# EAGLE design 5V_XL4016_Buck_Converter_2023_05_04_A (EAGLE 9.6.1)
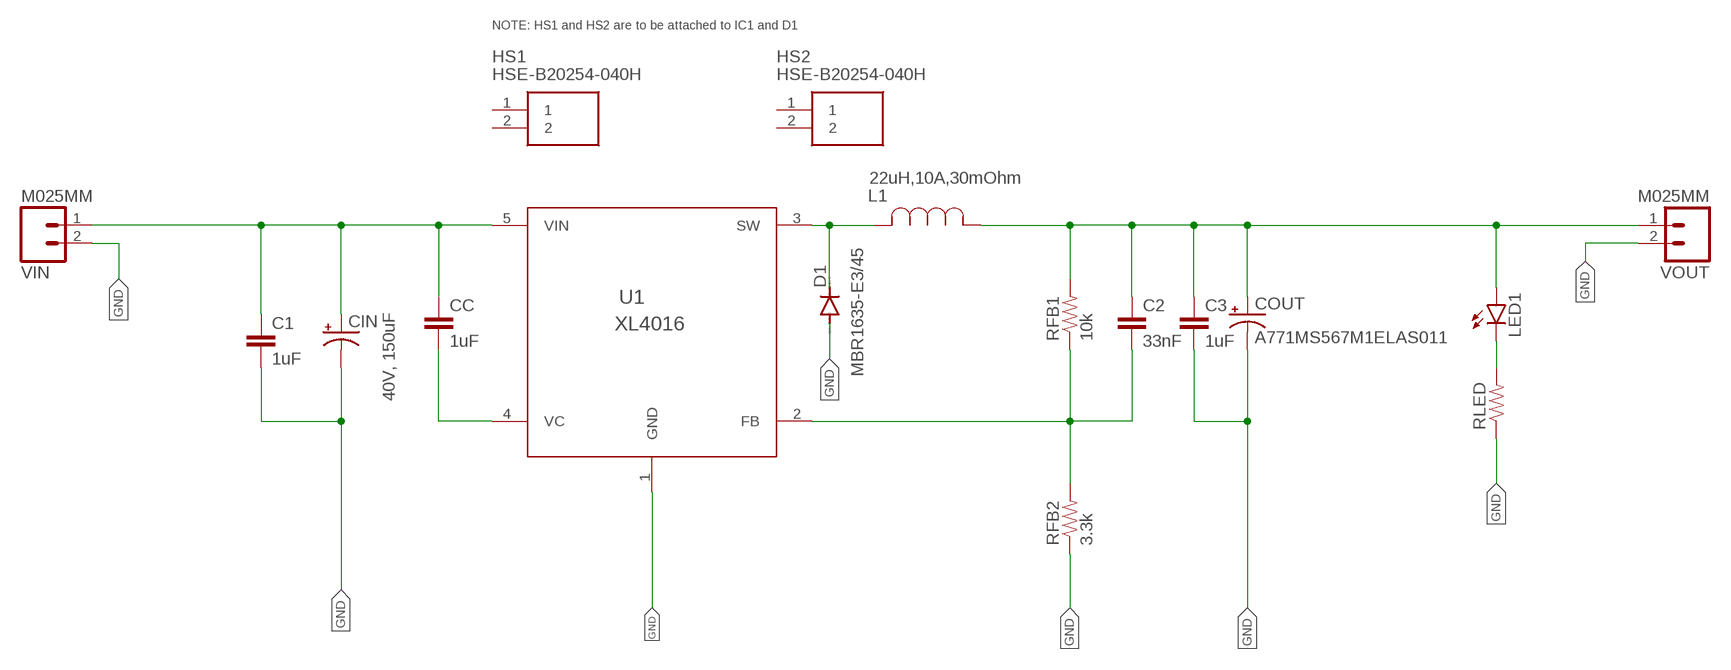
[diagram p0: schematic, sheet 1]

## Parts
C1  1uF  CAP0805  [0805]
C2  33nF  CAP0805  [0805]
C3  1uF  CAP0805  [0805]
CC  1uF  CAP0805  [0805]
CIN  40V, 150uF  A768KS157M1GLAS025CAP_A768_KEM-M  [CAP_A768_KEM-M]
COUT  A771MS567M1ELAS011  CPOL-US153CLV-1012  [153CLV-1012]
D1  MBR1635-E3/45  FES08AT  [DO220S]
HS1  HSE-B20254-040H  [HSEB20254040H]
HS2  HSE-B20254-040H  [HSEB20254040H]
L1  22uH,10A,30mOhm  SRP1265C-4R7MIND_SRP1265C-LEADFRAME_BRN-M  [IND_SRP1265C-LEADFRAME_BRN-M]
LED1  LED1206  [LED-1206]
RFB1  10k  RESISTOR0805-RES  [0805]
RFB2  3.3k  RESISTOR0805-RES  [0805]
RLED  RESISTOR0805-RES  [0805]
U1  XL4016  [TO220-5L]
VIN  M025MM  [SCREWTERMINAL-5MM-2]
VOUT  M025MM  [SCREWTERMINAL-5MM-2]

## Nets
FB: C2.2 RFB1.1 RFB2.2 U1.2(FB)
GND: C1.2 C3.2 CIN.2(-) COUT.- D1.A RFB2.1 RLED.1 U1.1(GND) VIN.2 VOUT.2
N$1: LED1.C RLED.2
SW: D1.C L1.2 U1.3(SW)
VC: CC.2 U1.4(VC)
VIN: C1.1 CC.1 CIN.1(+) U1.5(VIN) VIN.1
VOUT: C2.1 C3.1 COUT.+ L1.1 LED1.A RFB1.2 VOUT.1
Unconnected: HS1.1 HS1.2 HS2.1 HS2.2

## Notes on the sheet
- NOTE: HS1 and HS2 are to be attached to IC1 and D1

## Library data of the parts
C1-C3 CC = SparkFun-Capacitors:CAP: Capacitor Standard 0603 ceramic capacitor, and 0.1" leaded capacitor.
CIN = KMET_A768_12mm:A768KS157M1GLAS025; COPYRIGHT: Copyright (C) 2023 Ultra Librarian. All rights reserved.; MANUFACTURER_PART_NUMBER: A768KS157M1GLAS025; MFR_NAME: Kemet
COUT = rcl:CPOL-US: POLARIZED CAPACITOR, American symbol; SPICEPREFIX: C
D1 = diode:FES08AT: DIODE ultra-fast recovery rectifier
HS1 HS2 = HSE-B20254-040H:HSE-B20254-040H: Heat Sinks 25.4x32x20mm w/pin extrusion TO-220 Source: Datasheet <https://datasheet.datasheetarchive.com/originals/distributors/DKDS-12/236902.pdf>; DESCRIPTION: Heat Sinks 25.4x32x20mm w/pin extrusion TO-220; HEIGHT: 25.9mm; MANUFACTURER_NAME: CUI Devices; MANUFACTURER_PART_NUMBER: HSE-B20254-040H; MOUSER_PART_NUMBER: 490-HSE-B20254-040H; MOUSER_PRICE-STOCK: https://www.mouser.co.uk/ProductDetail/CUI-Devices/HSE-B20254-040H?qs=5aG0NVq1C4wagxcVQ2hrmA%3D%3D
L1 = SRP1265C-220M:SRP1265C-4R7M; COPYRIGHT: Copyright (C) 2023 Ultra Librarian. All rights reserved.; MANUFACTURER_PART_NUMBER: SRP1265C-4R7M; MFR_NAME: Bourns Electronics; TYPE: Fixed Inductors
LED1 = SparkFun-LED:LED: LEDs Standard schematic elements and footprints for 5mm, 3mm, 1206, and 0603 sized LEDs. 5mm - Spark Fun Electronics SKU : COM-00529 (and others)
RFB1 RFB2 RLED = SparkFun-Resistors:RESISTOR: Resistor Basic schematic elements and footprints for 0603, 1206, and PTH resistors.
U1 = XL4016:XL4016; COPYRIGHT: Copyright (C) 2023 Ultra Librarian. All rights reserved.; MANUFACTURER_PART_NUMBER: LM2575T-12/NOPB; MFR_NAME: Texas Instruments; REFDES: RefDes; TYPE: TYPE
VIN VOUT = SparkFun-Connectors:M02: Standard 2-pin 0.1" header. Use with - straight break away headers ( PRT-00116) - right angle break away headers (PRT-00553) - swiss pins (PRT-00743) - machine pins (PRT-00117) - female headers (PRT-00115) Molex polarized connector foot print use with: PRT-08233 with associated crimp pins and housings. 2.54_SCREWTERM for use with PRT-10571. 3.5mm Screw Terminal footprints for PRT-08084 5mm Screw Terminal footprints for use with PRT-08432; STOREFRONT_ID: PRT-08432

## Board
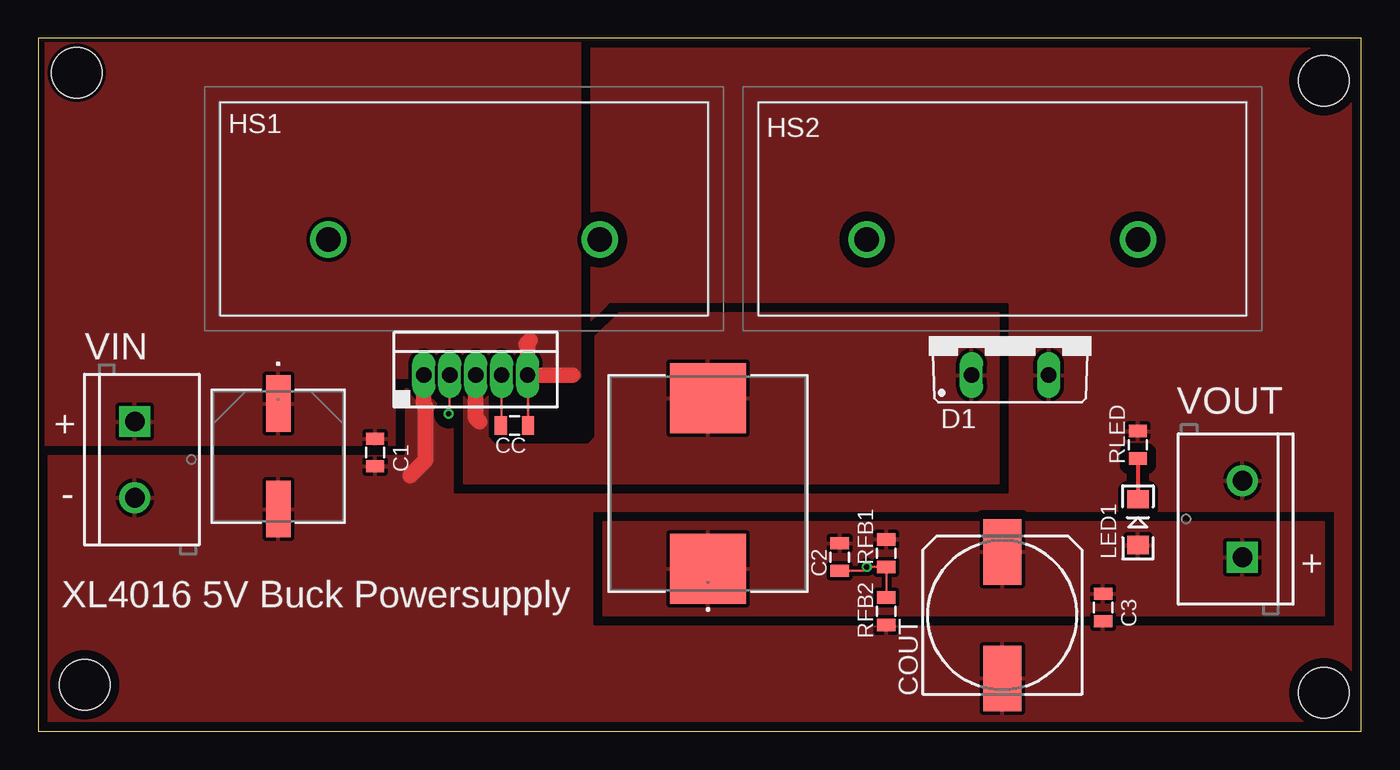
[diagram p1: board, top side]
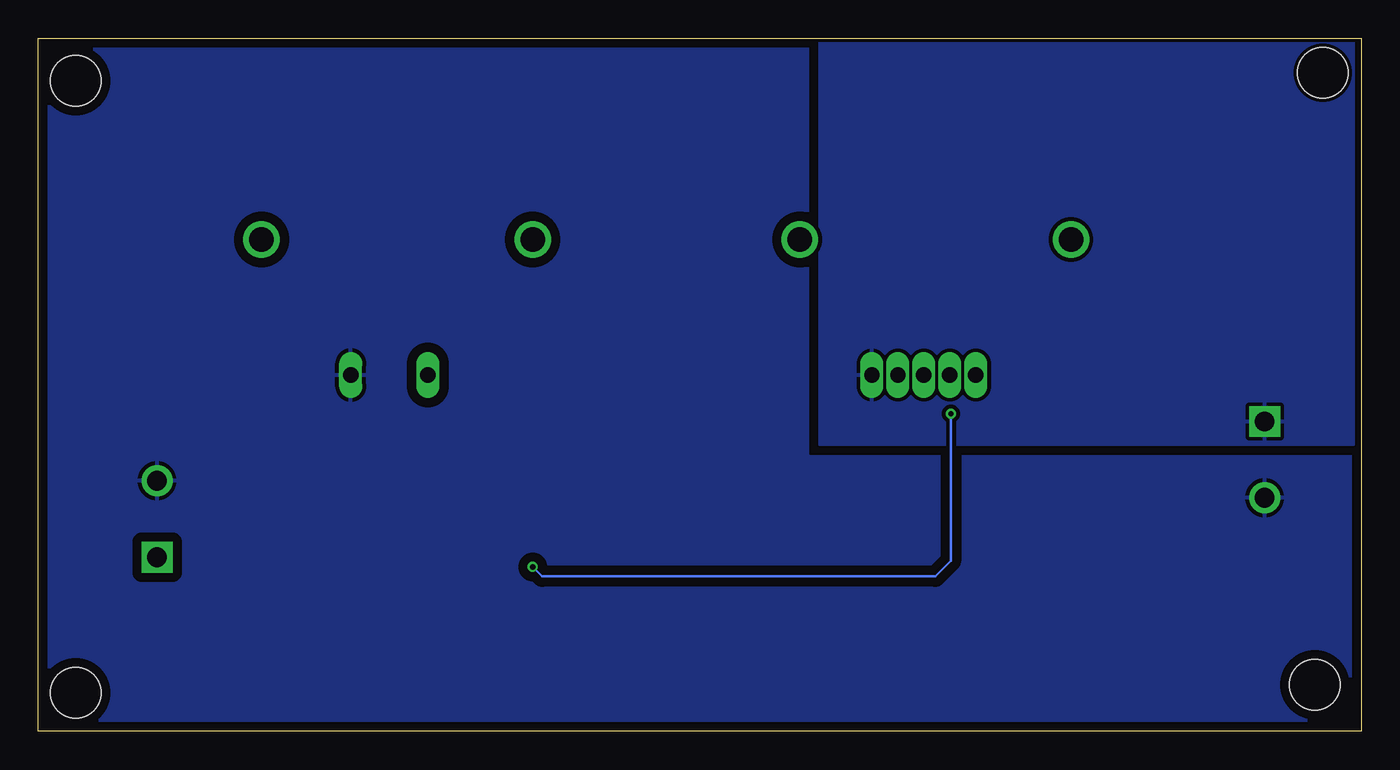
[diagram p2: board, bottom side, seen from below]

Size 86.79 x 45.46 mm. Coordinates in mm from the lower left corner, seen from the top.
Outline: 0,0 86.79,0 86.79,45.46 0,45.46 0,0
Copper layers (1*16): Top 0.035mm / dielectric 1.5mm / Bottom 0.035mm
Design rules "default": minimum track width 5mil, minimum drill 5mil, track to track 10mil, track to pad 10mil, pad to pad 10mil, via to via 10mil, smd to smd 6mil, copper to edge 10mil, drill to drill 6mil, minimum pad ring 6mil, minimum via ring 6mil, stop-mask expansion 4mil, vias tented up to drill 0mil, thermal gap 10mil
Holes 3.3 mm at 2.54,43.18 84.33,42.67 3.05,3.05 84.33,2.54

### Footprints (pad centres in the part's own frame; a part is rotated, then mirrored left to right if it is on the bottom)
0805 = smd 0.8 x 1.2: 1 -0.9,0; 2 0.9,0
CAP_A768_KEM-M = smd 3.708 x 1.6: 1 -3.454,0; 2 3.454,0
153CLV-1012 = smd 4.3 x 2.5: + 4.15,0; - -4.15,0
DO220S = drill 1.016 long: A 2.54,-2.54; C -2.54,-2.54
HSEB20254040H = drill 1.6 pad 2.4: 1 0,0; 2 17.78,0
IND_SRP1265C-LEADFRAME_BRN-M = smd 4.572 x 5.004: 1 -5.588,0; 2 5.588,0
LED-1206 = smd 1.2 x 1.4: A -1.5,0; C 1.5,0
TO220-5L = drill 1 pad 1.27 long: 1 0,3.404; 2 0,1.702; 3 0,0; 4 0,-1.702; 5 0,-3.404
SCREWTERMINAL-5MM-2 = drill 1.3 pad 2.032 square: 1 0,0 | drill 1.3 pad 2.032: 2 5,0

### Placement (x,y rotation side)
C1  22.1,18.29 270 top
C2  52.58,11.43 270 top
C3  69.85,8.13 270 top
CC  31.24,20.07 180 top
CIN  15.75,18.03 270 top
COUT  63.25,7.62 90 top
D1  63.75,25.91 0 top
HS1  19.05,32.26 0 top
HS2  54.36,32.26 0 top
L1  43.94,16.26 90 top
LED1  72.14,13.72 90 top
RFB1  55.63,11.68 90 top
RFB2  55.63,7.87 90 top
RLED  72.14,18.8 270 top
U1  28.7,23.37 90 top
VIN  6.35,20.32 270 top
VOUT  78.99,11.43 90 top

### Tracks (layer width: path | path; a pad name or v marks a point on that pad's centre or on a via)
FB  (via drill 0.35)
  Top 0.152: U1.2 27,20.9 v26.92,20.83 | RFB2.2 RFB1.1 v54.36,10.78 54.1,10.53 C2.2
  Bottom 0.152: v26.92,20.83 26.92,11.18 27.94,10.16 53.73,10.16 v54.36,10.78
GND
  Top 1.016: U1.1 25.3,21.44 25.4,21.34 25.4,17.78 24.38,16.76
  pour Top (isolate 0.61, rank 6): 1.52,47.75 86.87,47.75 86.87,0 84.84,-2.03 1.52,-2.03 -1.52,1.02 -1.52,44.7
  pour Bottom (isolate 0.61, rank 6): -1.52,52.83 89.92,52.83 90.42,52.32 90.42,-4.06 89.92,-4.57 88.9,-5.59 -2.03,-5.59 -2.03,52.32
N$1
  Top 0.254: RLED.2 LED1.C
SW
  Top 1.016: U1.3 28.7,20.57 28.96,20.32
  pour Top: 27.94,24.38 27.94,16.26 62.99,16.26 62.99,27.43 38.1,27.43 36.58,25.91 36.58,19.3 36.07,18.8 29.97,18.8 29.46,19.3 29.46,24.38
VC
  Top 0.152: U1.4 30.4,20.13 CC.2
VIN
  Top 0.152: CC.1 32.14,23.33 U1.5
  Top 1.016: 32.26,25.65 32,25.4 32.11,25.3 U1.5 35.05,23.37
  pour Top: 0.51,18.8 23.37,18.8 23.37,23.2 35.56,23.2 35.56,45.21 0.51,45.21
  pour Bottom: 0.51,18.8 35.56,18.8 35.56,45.21 0.51,45.21
VOUT
  pour Top: 37.08,13.72 84.33,13.72 84.33,7.62 37.08,7.62

### Text on the board
tPlace: VIN | VOUT | + | - | + | XL4016 5V Buck Powersupply